# EAGLE design ampjack_v0001 (EAGLE 6.4)

## Sheet 1 of 11: MCU
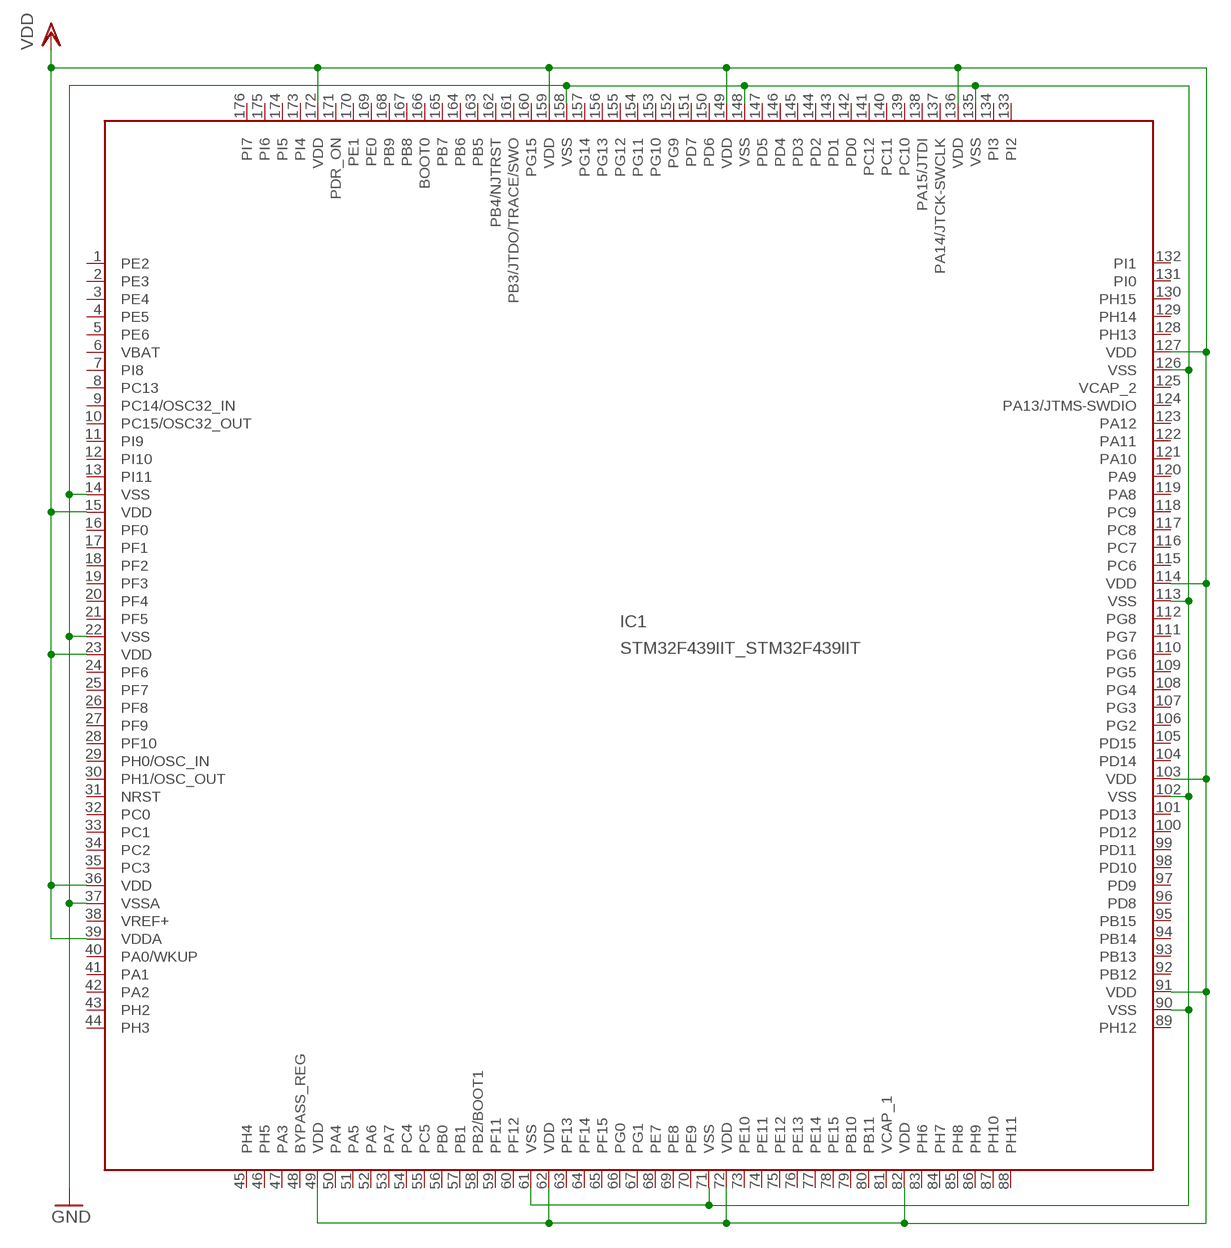
[diagram p0: schematic, sheet 1]

### Parts
IC1  STM32F439IIT_STM32F439IIT  [STM32F439IIT_LQFP-176]

### Nets
GND: IC1.14(VSS) IC1.22(VSS) IC1.37(VSSA) IC1.61(VSS) IC1.71(VSS) IC1.90(VSS) IC1.102(VSS) IC1.113(VSS) IC1.126(VSS) IC1.135(VSS) IC1.148(VSS) IC1.158(VSS) ; also sheet 5,6,7,8
VDD: IC1.15(VDD) IC1.23(VDD) IC1.36(VDD) IC1.39(VDDA) IC1.49(VDD) IC1.62(VDD) IC1.72(VDD) IC1.82(VDD) IC1.91(VDD) IC1.103(VDD) IC1.114(VDD) IC1.127(VDD) IC1.136(VDD) IC1.149(VDD) IC1.159(VDD) IC1.172(VDD)
Unconnected: IC1.1(PE2) IC1.2(PE3) IC1.3(PE4) IC1.4(PE5) IC1.5(PE6) IC1.7(PI8) IC1.8(PC13) IC1.9(PC14/OSC32_IN) IC1.10(PC15/OSC32_OUT) IC1.11(PI9) IC1.12(PI10) IC1.13(PI11) IC1.16(PF0) IC1.17(PF1) IC1.18(PF2) IC1.19(PF3) IC1.20(PF4) IC1.21(PF5) IC1.24(PF6) IC1.25(PF7) IC1.26(PF8) IC1.27(PF9) IC1.28(PF10) IC1.29(PH0/OSC_IN) IC1.30(PH1/OSC_OUT) IC1.31(NRST) IC1.32(PC0) IC1.33(PC1) IC1.34(PC2) IC1.35(PC3) IC1.40(PA0/WKUP) IC1.41(PA1) IC1.42(PA2) IC1.43(PH2) IC1.44(PH3) IC1.45(PH4) IC1.46(PH5) IC1.47(PA3) IC1.48(BYPASS_REG) IC1.50(PA4) IC1.51(PA5) IC1.52(PA6) IC1.53(PA7) IC1.54(PC4) IC1.55(PC5) IC1.56(PB0) IC1.57(PB1) IC1.58(PB2/BOOT1) IC1.59(PF11) IC1.60(PF12) IC1.63(PF13) IC1.64(PF14) IC1.65(PF15) IC1.66(PG0) IC1.67(PG1) IC1.68(PE7) IC1.69(PE8) IC1.70(PE9) IC1.73(PE10) IC1.74(PE11) IC1.75(PE12) IC1.76(PE13) IC1.77(PE14) IC1.78(PE15) IC1.79(PB10) IC1.80(PB11) IC1.83(PH6) IC1.84(PH7) IC1.85(PH8) IC1.86(PH9) IC1.87(PH10) IC1.88(PH11) IC1.89(PH12) IC1.92(PB12) IC1.93(PB13) IC1.94(PB14) IC1.95(PB15) IC1.96(PD8) IC1.97(PD9) IC1.98(PD10) IC1.99(PD11) IC1.100(PD12) IC1.101(PD13) IC1.104(PD14) IC1.105(PD15) IC1.106(PG2) IC1.107(PG3) IC1.108(PG4) IC1.109(PG5) IC1.110(PG6) IC1.111(PG7) IC1.112(PG8) IC1.115(PC6) IC1.116(PC7) IC1.117(PC8) IC1.118(PC9) IC1.119(PA8) IC1.120(PA9) IC1.121(PA10) IC1.122(PA11) IC1.123(PA12) IC1.124(PA13/JTMS-SWDIO) IC1.128(PH13) IC1.129(PH14) IC1.130(PH15) IC1.131(PI0) IC1.132(PI1) IC1.133(PI2) IC1.134(PI3) IC1.137(PA14/JTCK-SWCLK) IC1.138(PA15/JTDI) IC1.139(PC10) IC1.140(PC11) IC1.141(PC12) IC1.142(PD0) IC1.143(PD1) IC1.144(PD2) IC1.145(PD3) IC1.146(PD4) IC1.147(PD5) IC1.150(PD6) IC1.151(PD7) IC1.152(PG9) IC1.153(PG10) IC1.154(PG11) IC1.155(PG12) IC1.156(PG13) IC1.157(PG14) IC1.160(PG15) IC1.161(PB3/JTDO/TRACE/SWO) IC1.162(PB4/NJTRST) IC1.163(PB5) IC1.164(PB6) IC1.165(PB7) IC1.166(BOOT0) IC1.167(PB8) IC1.168(PB9) IC1.169(PE0) IC1.170(PE1) IC1.173(PI4) IC1.174(PI5) IC1.175(PI6) IC1.176(PI7)

## Sheet 2 of 11: HP_IN
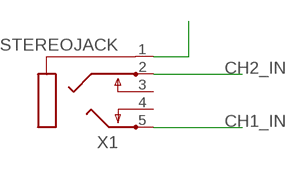
[diagram p1: schematic, sheet 2]

### Parts
X1  STEREOJACK  [STX3100]

### Nets
CH1_IN: X1.5 ; also sheet 5
CH2_IN: X1.2 ; also sheet 6
N$138: X1.1
Unconnected: X1.3 X1.4

## Sheet 3 of 11: Current - CH1

## Sheet 4 of 11: Current - CH2

## Sheet 5 of 11: AFE - CH1
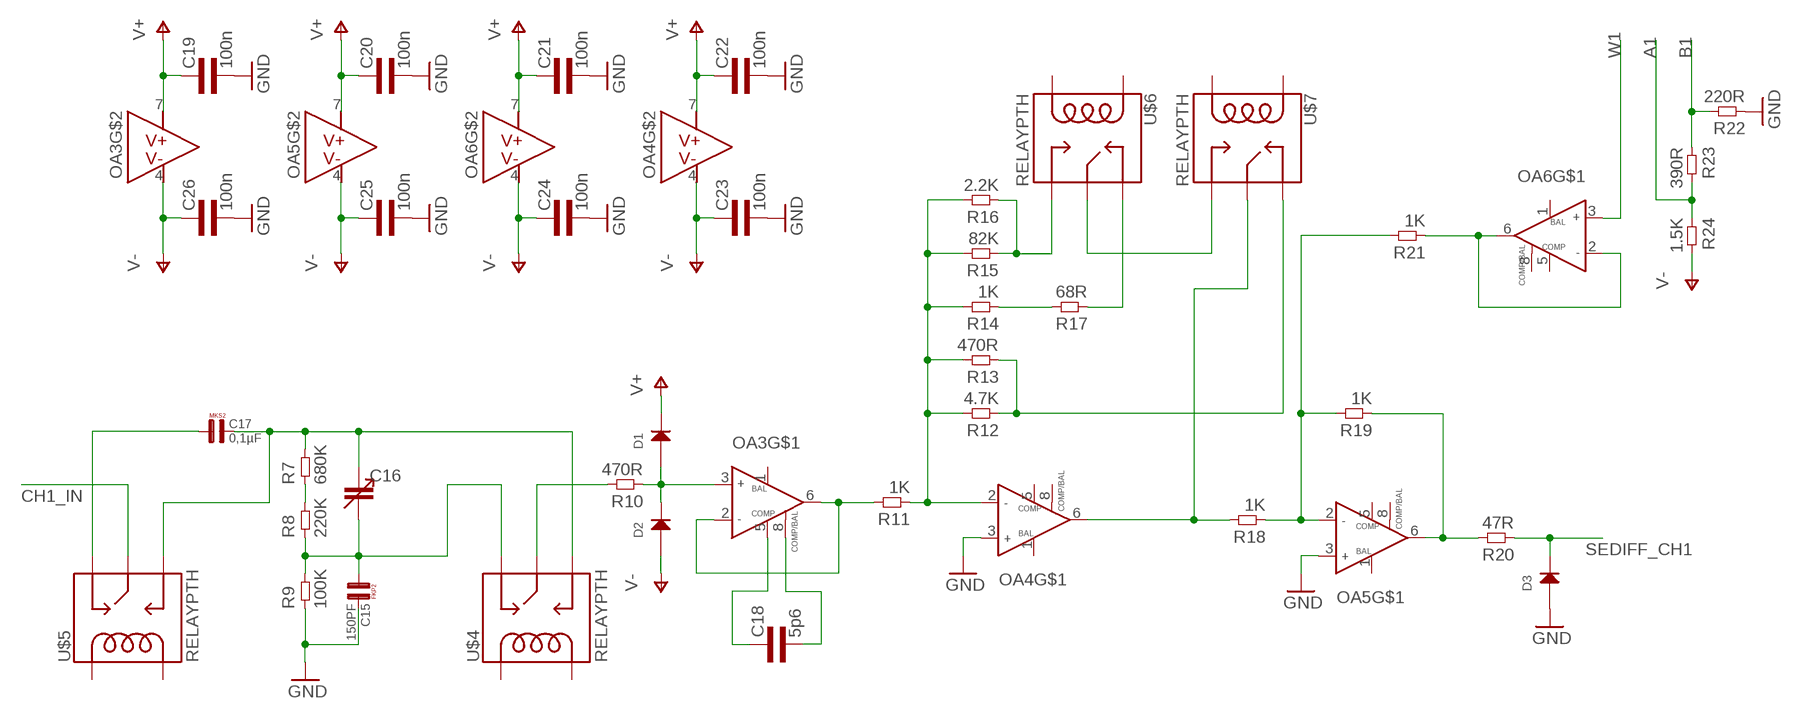
[diagram p2: schematic, sheet 5]

### Parts
C15  150PF  [R5B4K5]
C16  CAP_ADJSMD  [CTZ3]
C17  0,1µF  [R5B3]
C18  5p6  CAP0603L3  [0603L3]
C19  100n  CAP0603L3  [0603L3]
C20  100n  CAP0603L3  [0603L3]
C21  100n  CAP0603L3  [0603L3]
C22  100n  CAP0603L3  [0603L3]
C23  100n  CAP0603L3  [0603L3]
C24  100n  CAP0603L3  [0603L3]
C25  100n  CAP0603L3  [0603L3]
C26  100n  CAP0603L3  [0603L3]
D1  DIODEDO-214AC  [DO-214AC]
D2  DIODEDO-214AC  [DO-214AC]
D3  DIODEDO-214AC  [DO-214AC]
OA3  NE5534ADSOIC8  [SOIC-8]
OA4  NE5534ADSOIC8  [SOIC-8]
OA5  NE5534ADSOIC8  [SOIC-8]
OA6  NE5534ADSOIC8  [SOIC-8]
R7  680K  RES0805L3  [0805L3]
R8  220K  RES0805L3  [0805L3]
R9  100K  RES0805L3  [0805L3]
R10  470R  RES0805L3  [0805L3]
R11  1K  RES0805L3  [0805L3]
R12  4.7K  RES0805L3  [0805L3]
R13  470R  RES0805L3  [0805L3]
R14  1K  RES0805L3  [0805L3]
R15  82K  RES0805L3  [0805L3]
R16  2.2K  RES0805L3  [0805L3]
R17  68R  RES0805L3  [0805L3]
R18  1K  RES0805L3  [0805L3]
R19  1K  RES0805L3  [0805L3]
R20  47R  RES0805L3  [0805L3]
R21  1K  RES0805L3  [0805L3]
R22  220R  RES0805L3  [0805L3]
R23  390R  RES0805L3  [0805L3]
R24  1.5K  RES0805L3  [0805L3]
U$4  RELAYPTH  [RELAY-G5Q]
U$5  RELAYPTH  [RELAY-G5Q]
U$6  RELAYPTH  [RELAY-G5Q]
U$7  RELAYPTH  [RELAY-G5Q]

### Nets
A1: R23.2 R24.1 ; also sheet 9
B1: R22.2 R23.1 ; also sheet 9
CH1_IN: U$5.2(MAIN) ; also sheet 2
GND: C15.2 C19.P$2 C20.P$2 C21.P$2 C22.P$2 C23.P$2 C24.P$2 C25.P$2 C26.P$2 D3.1(ANODE) OA4.3(IN+) OA5.3(IN+) R9.1 R22.1 ; also sheet 1,6,7,8
N$42: C17.1 U$5.4(NC)
N$43: C16.+ C17.2 R7.2 U$4.3(NO) U$5.3(NO)
N$44: R7.1 R8.2
N$45: C15.1 C16.- R8.1 R9.2 U$4.4(NC)
N$48: R10.2 U$4.2(MAIN)
N$49: D1.1(ANODE) D2.2(CATHODE) OA3.3(IN+) R10.1
N$52: OA3.2(IN-) OA3.6(OUT) R11.2
N$53: C18.P$1 OA3.5(COMP)
N$54: C18.P$2 OA3.8(COMP/BAL)
N$55: OA4.2(IN-) R11.1 R12.2 R13.2 R14.2 R15.2 R16.2
N$56: R12.1 R13.1 U$7.4(NC)
N$57: U$6.2(MAIN) U$7.3(NO)
N$58: R14.1 R17.2
N$59: R17.1 U$6.4(NC)
N$60: R15.1 R16.1 U$6.3(NO)
N$61: OA4.6(OUT) R18.2 U$7.2(MAIN)
N$62: OA5.2(IN-) R18.1 R19.2 R21.2
N$63: OA5.6(OUT) R19.1 R20.2
N$65: OA6.2(IN-) OA6.6(OUT) R21.1
SEDIFF_CH1: D3.2(CATHODE) R20.1 ; also sheet 7
V+: C19.P$1 C20.P$1 C21.P$1 C22.P$1 D1.2(CATHODE) OA3.7(V+) OA4.7(V+) OA5.7(V+) OA6.7(V+) ; also sheet 6,7,8
V-: C23.P$1 C24.P$1 C25.P$1 C26.P$1 D2.1(ANODE) OA3.4(V-) OA4.4(V-) OA5.4(V-) OA6.4(V-) R24.2 ; also sheet 6,7,8
W1: OA6.3(IN+) ; also sheet 9
Unconnected: OA3.1(BAL) OA4.1(BAL) OA4.5(COMP) OA4.8(COMP/BAL) OA5.1(BAL) OA5.5(COMP) OA5.8(COMP/BAL) OA6.1(BAL) OA6.5(COMP) OA6.8(COMP/BAL) U$4.1(COIL2) U$4.5(COIL1) U$5.1(COIL2) U$5.5(COIL1) U$6.1(COIL2) U$6.5(COIL1) U$7.1(COIL2) U$7.5(COIL1)

## Sheet 6 of 11: AFE - CH2
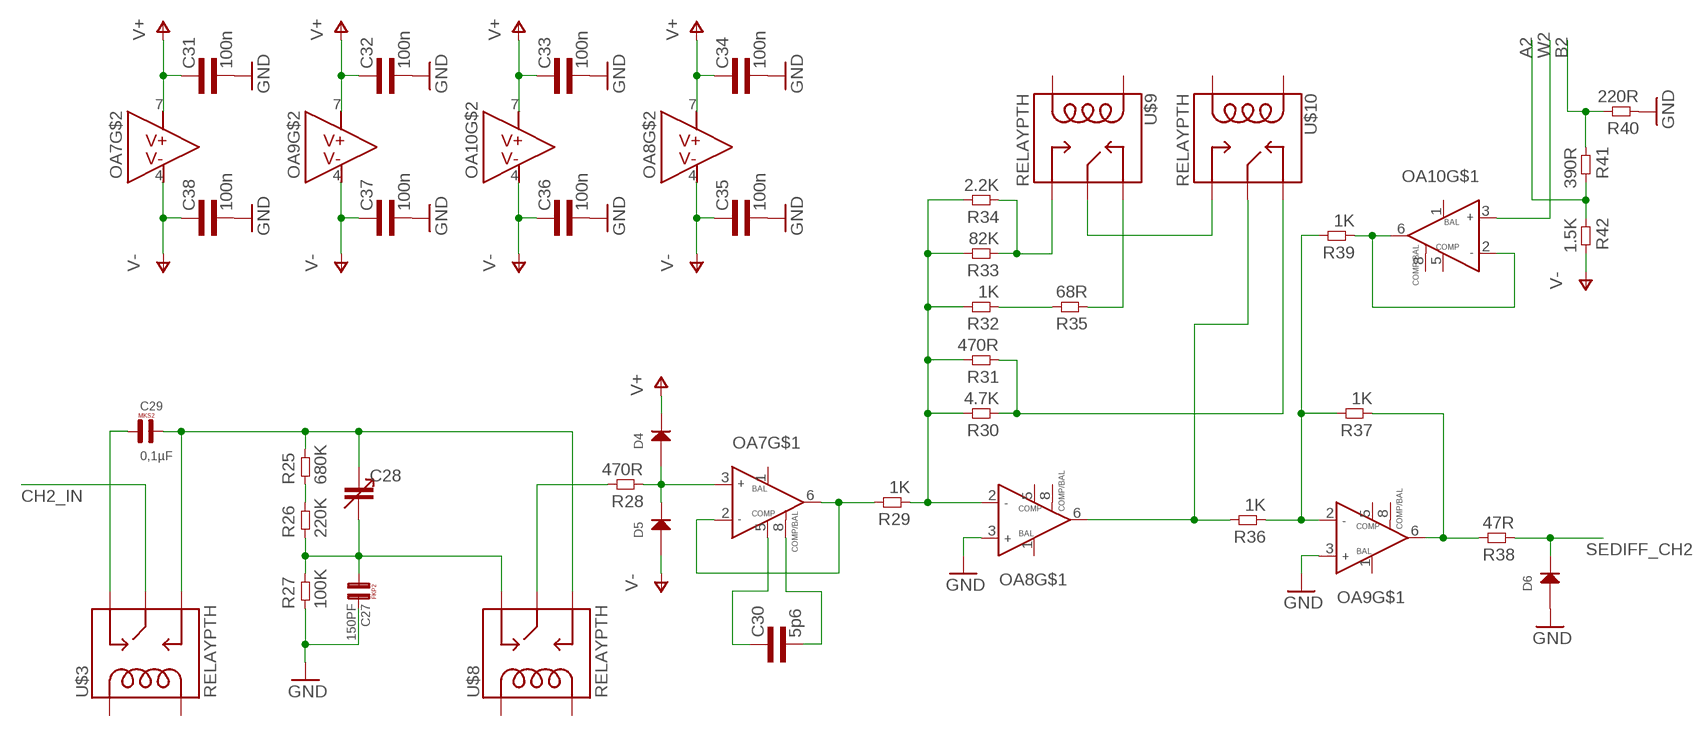
[diagram p3: schematic, sheet 6]

### Parts
C27  150PF  [R5B4K5]
C28  CAP_ADJSMD  [CTZ3]
C29  0,1µF  [R5B3]
C30  5p6  CAP0603L3  [0603L3]
C31  100n  CAP0603L3  [0603L3]
C32  100n  CAP0603L3  [0603L3]
C33  100n  CAP0603L3  [0603L3]
C34  100n  CAP0603L3  [0603L3]
C35  100n  CAP0603L3  [0603L3]
C36  100n  CAP0603L3  [0603L3]
C37  100n  CAP0603L3  [0603L3]
C38  100n  CAP0603L3  [0603L3]
D4  DIODEDO-214AC  [DO-214AC]
D5  DIODEDO-214AC  [DO-214AC]
D6  DIODEDO-214AC  [DO-214AC]
OA7  NE5534ADSOIC8  [SOIC-8]
OA8  NE5534ADSOIC8  [SOIC-8]
OA9  NE5534ADSOIC8  [SOIC-8]
OA10  NE5534ADSOIC8  [SOIC-8]
R25  680K  RES0805L3  [0805L3]
R26  220K  RES0805L3  [0805L3]
R27  100K  RES0805L3  [0805L3]
R28  470R  RES0805L3  [0805L3]
R29  1K  RES0805L3  [0805L3]
R30  4.7K  RES0805L3  [0805L3]
R31  470R  RES0805L3  [0805L3]
R32  1K  RES0805L3  [0805L3]
R33  82K  RES0805L3  [0805L3]
R34  2.2K  RES0805L3  [0805L3]
R35  68R  RES0805L3  [0805L3]
R36  1K  RES0805L3  [0805L3]
R37  1K  RES0805L3  [0805L3]
R38  47R  RES0805L3  [0805L3]
R39  1K  RES0805L3  [0805L3]
R40  220R  RES0805L3  [0805L3]
R41  390R  RES0805L3  [0805L3]
R42  1.5K  RES0805L3  [0805L3]
U$3  RELAYPTH  [RELAY-G5Q]
U$8  RELAYPTH  [RELAY-G5Q]
U$9  RELAYPTH  [RELAY-G5Q]
U$10  RELAYPTH  [RELAY-G5Q]

### Nets
A2: R41.2 R42.1 ; also sheet 9
B2: R40.2 R41.1 ; also sheet 9
CH2_IN: U$3.2(MAIN) ; also sheet 2
GND: C27.2 C31.P$2 C32.P$2 C33.P$2 C34.P$2 C35.P$2 C36.P$2 C37.P$2 C38.P$2 D6.1(ANODE) OA8.3(IN+) OA9.3(IN+) R27.1 R40.1 ; also sheet 1,5,7,8
N$46: C29.1 U$3.4(NC)
N$47: C28.+ C29.2 R25.2 U$3.3(NO) U$8.3(NO)
N$50: R25.1 R26.2
N$51: C27.1 C28.- R26.1 R27.2 U$8.4(NC)
N$66: R28.2 U$8.2(MAIN)
N$68: D4.1(ANODE) D5.2(CATHODE) OA7.3(IN+) R28.1
N$69: OA7.2(IN-) OA7.6(OUT) R29.2
N$70: C30.P$1 OA7.5(COMP)
N$71: C30.P$2 OA7.8(COMP/BAL)
N$72: OA8.2(IN-) R29.1 R30.2 R31.2 R32.2 R33.2 R34.2
N$73: R30.1 R31.1 U$10.4(NC)
N$74: U$9.2(MAIN) U$10.3(NO)
N$75: R32.1 R35.2
N$76: R35.1 U$9.4(NC)
N$77: R33.1 R34.1 U$9.3(NO)
N$78: OA8.6(OUT) R36.2 U$10.2(MAIN)
N$79: OA9.2(IN-) R36.1 R37.2 R39.2
N$80: OA9.6(OUT) R37.1 R38.2
N$82: OA10.2(IN-) OA10.6(OUT) R39.1
SEDIFF_CH2: D6.2(CATHODE) R38.1 ; also sheet 8
V+: C31.P$1 C32.P$1 C33.P$1 C34.P$1 D4.2(CATHODE) OA7.7(V+) OA8.7(V+) OA9.7(V+) OA10.7(V+) ; also sheet 5,7,8
V-: C35.P$1 C36.P$1 C37.P$1 C38.P$1 D5.1(ANODE) OA7.4(V-) OA8.4(V-) OA9.4(V-) OA10.4(V-) R42.2 ; also sheet 5,7,8
W2: OA10.3(IN+) ; also sheet 9
Unconnected: OA7.1(BAL) OA8.1(BAL) OA8.5(COMP) OA8.8(COMP/BAL) OA9.1(BAL) OA9.5(COMP) OA9.8(COMP/BAL) OA10.1(BAL) OA10.5(COMP) OA10.8(COMP/BAL) U$3.1(COIL2) U$3.5(COIL1) U$8.1(COIL2) U$8.5(COIL1) U$9.1(COIL2) U$9.5(COIL1) U$10.1(COIL2) U$10.5(COIL1)

## Sheet 7 of 11: SE to Diff - CH1
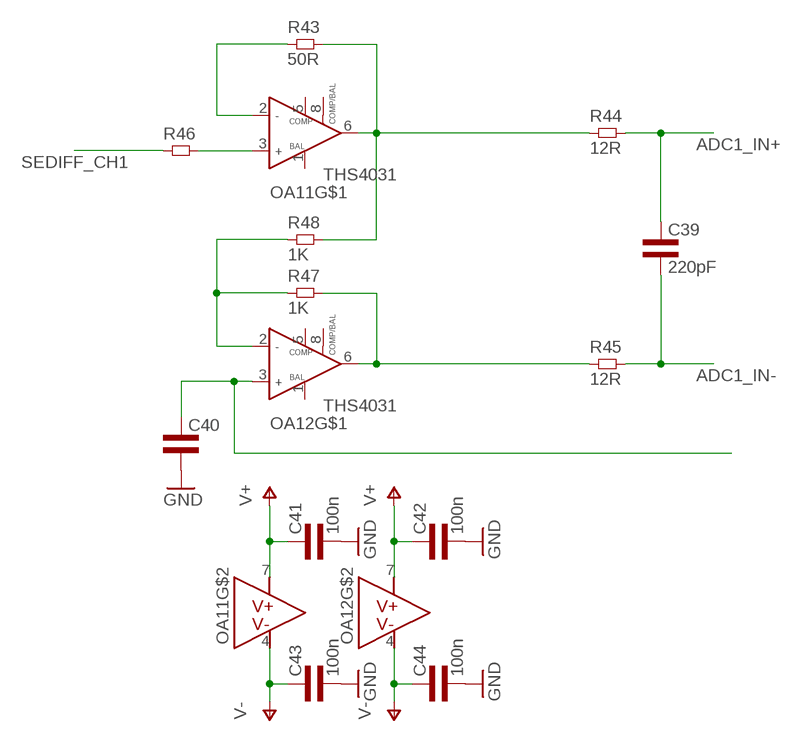
[diagram p4: schematic, sheet 7]

### Parts
C39  220pF  CAP0603L3  [0603L3]
C40  CAP0603L3  [0603L3]
C41  100n  CAP0603L3  [0603L3]
C42  100n  CAP0603L3  [0603L3]
C43  100n  CAP0603L3  [0603L3]
C44  100n  CAP0603L3  [0603L3]
OA11  THS4031  NE5534DSOIC8  [SOIC-8]
OA12  THS4031  NE5534DSOIC8  [SOIC-8]
R43  50R  RES0603L3  [0603L3]
R44  12R  RES0603L3  [0603L3]
R45  12R  RES0603L3  [0603L3]
R46  RES0603L3  [0603L3]
R47  1K  RES0603L3  [0603L3]
R48  1K  RES0603L3  [0603L3]

### Nets
ADC1_COMMOUT: C40.P$1 OA12.3(IN+) ; also sheet 10
ADC1_IN+: C39.P$1 R44.P$2 ; also sheet 10
ADC1_IN-: C39.P$2 R45.P$2 ; also sheet 10
GND: C40.P$2 C41.P$2 C42.P$2 C43.P$2 C44.P$2 ; also sheet 1,5,6,8
N$84: OA11.6(OUT) R43.P$2 R44.P$1 R48.P$2
N$85: OA12.6(OUT) R45.P$1 R47.P$2
N$89: OA11.2(IN-) R43.P$1
N$90: OA11.3(IN+) R46.P$2
N$91: OA12.2(IN-) R47.P$1 R48.P$1
SEDIFF_CH1: R46.P$1 ; also sheet 5
V+: C41.P$1 C42.P$1 OA11.7(V+) OA12.7(V+) ; also sheet 5,6,8
V-: C43.P$1 C44.P$1 OA11.4(V-) OA12.4(V-) ; also sheet 5,6,8
Unconnected: OA11.1(BAL) OA11.5(COMP) OA11.8(COMP/BAL) OA12.1(BAL) OA12.5(COMP) OA12.8(COMP/BAL)

## Sheet 8 of 11: SE to Diff - CH2
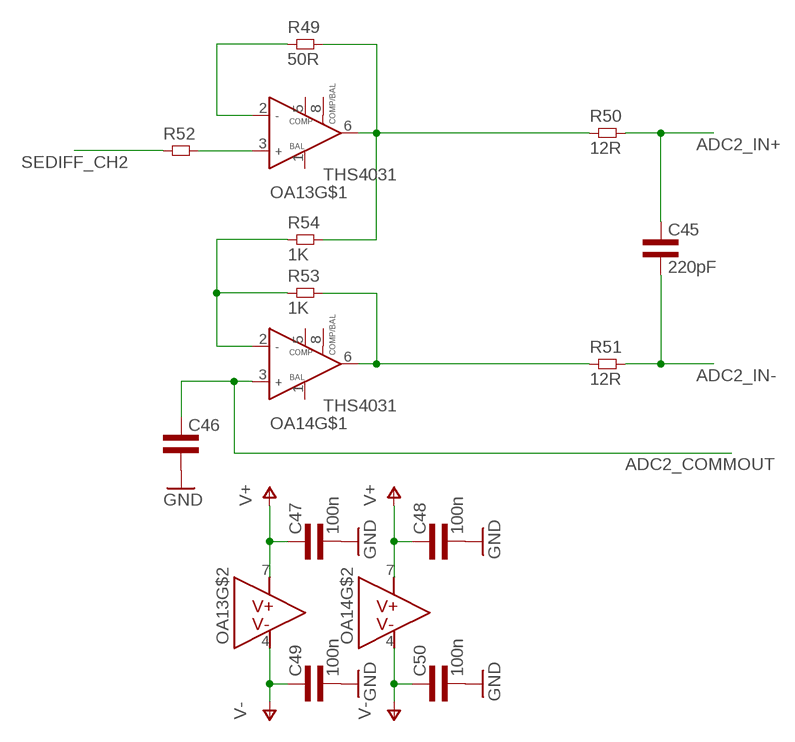
[diagram p5: schematic, sheet 8]

### Parts
C45  220pF  CAP0603L3  [0603L3]
C46  CAP0603L3  [0603L3]
C47  100n  CAP0603L3  [0603L3]
C48  100n  CAP0603L3  [0603L3]
C49  100n  CAP0603L3  [0603L3]
C50  100n  CAP0603L3  [0603L3]
OA13  THS4031  NE5534DSOIC8  [SOIC-8]
OA14  THS4031  NE5534DSOIC8  [SOIC-8]
R49  50R  RES0603L3  [0603L3]
R50  12R  RES0603L3  [0603L3]
R51  12R  RES0603L3  [0603L3]
R52  RES0603L3  [0603L3]
R53  1K  RES0603L3  [0603L3]
R54  1K  RES0603L3  [0603L3]

### Nets
ADC2_COMMOUT: C46.P$1 OA14.3(IN+) ; also sheet 11
ADC2_IN+: C45.P$1 R50.P$2 ; also sheet 11
ADC2_IN-: C45.P$2 R51.P$2 ; also sheet 11
GND: C46.P$2 C47.P$2 C48.P$2 C49.P$2 C50.P$2 ; also sheet 1,5,6,7
N$94: OA13.6(OUT) R49.P$2 R50.P$1 R54.P$2
N$95: OA14.6(OUT) R51.P$1 R53.P$2
N$98: OA13.2(IN-) R49.P$1
N$99: OA13.3(IN+) R52.P$2
N$100: OA14.2(IN-) R53.P$1 R54.P$1
SEDIFF_CH2: R52.P$1 ; also sheet 6
V+: C47.P$1 C48.P$1 OA13.7(V+) OA14.7(V+) ; also sheet 5,6,7
V-: C49.P$1 C50.P$1 OA13.4(V-) OA14.4(V-) ; also sheet 5,6,7
Unconnected: OA13.1(BAL) OA13.5(COMP) OA13.8(COMP/BAL) OA14.1(BAL) OA14.5(COMP) OA14.8(COMP/BAL)

## Sheet 9 of 11: Digi Pot
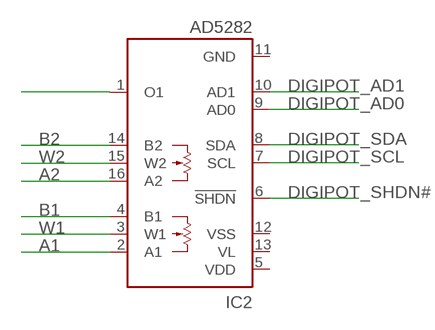
[diagram p6: schematic, sheet 9]

### Parts
IC2  AD5282  [TSSOP16]

### Nets
A1: IC2.2(A1) ; also sheet 5
A2: IC2.16(A2) ; also sheet 6
B1: IC2.4(B1) ; also sheet 5
B2: IC2.14(B2) ; also sheet 6
DIGIPOT_AD0: IC2.9(AD0)
DIGIPOT_AD1: IC2.10(AD1)
DIGIPOT_SCL: IC2.7(SCL)
DIGIPOT_SDA: IC2.8(SDA)
DIGIPOT_SHDN#: IC2.6(!SHDN)
N$87: IC2.1(O1)
W1: IC2.3(W1) ; also sheet 5
W2: IC2.15(W2) ; also sheet 6

## Sheet 10 of 11: ADC - CH1
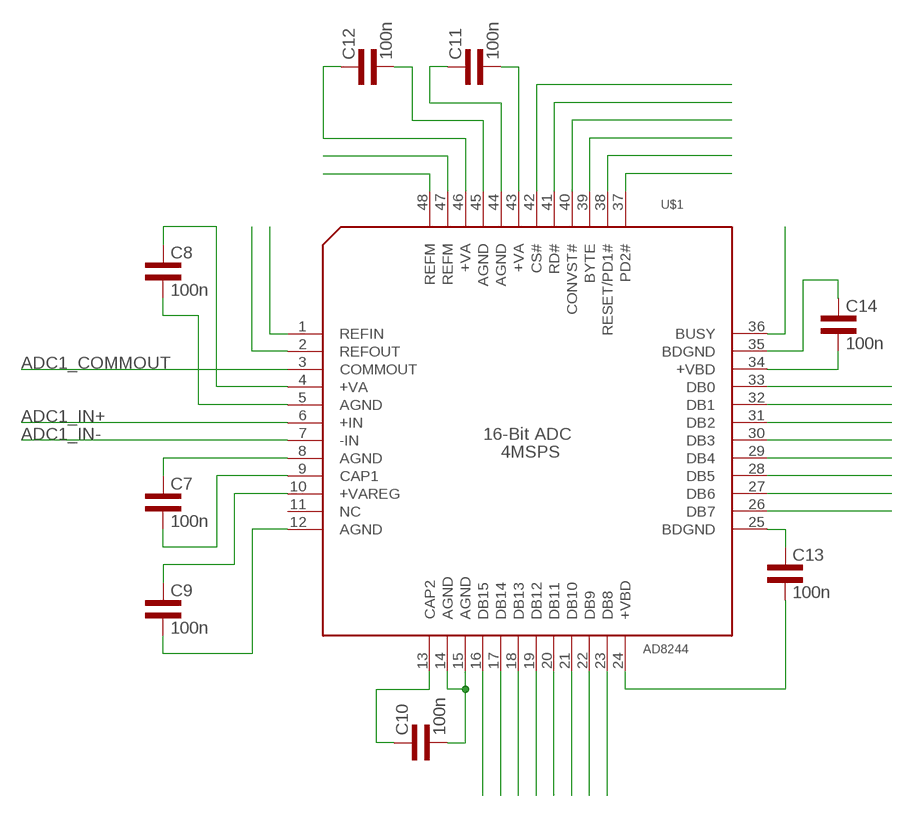
[diagram p7: schematic, sheet 10]

### Parts
C7  100n  CAP0402L3  [0402L3]
C8  100n  CAP0402L3  [0402L3]
C9  100n  CAP0402L3  [0402L3]
C10  100n  CAP0402L3  [0402L3]
C11  100n  CAP0402L3  [0402L3]
C12  100n  CAP0402L3  [0402L3]
C13  100n  CAP0402L3  [0402L3]
C14  100n  CAP0402L3  [0402L3]
U$1  AD8422  [S-PQFP-G48]

### Nets
ADC1_COMMOUT: U$1.3(COMMOUT) ; also sheet 7
ADC1_IN+: U$1.6(+IN) ; also sheet 7
ADC1_IN-: U$1.7(-IN) ; also sheet 7
N$10: U$1.16(DB15)
N$11: U$1.17(DB14)
N$12: U$1.18(DB13)
N$13: U$1.19(DB12)
N$14: U$1.20(DB11)
N$15: U$1.21(DB10)
N$16: U$1.22(DB9)
N$17: U$1.23(DB8)
N$18: U$1.26(DB7)
N$19: U$1.27(DB6)
N$20: U$1.28(DB5)
N$21: U$1.29(DB4)
N$22: U$1.30(DB3)
N$23: U$1.31(DB2)
N$24: U$1.32(DB1)
N$25: U$1.33(DB0)
N$26: C8.P$2 U$1.5(AGND)
N$27: C8.P$1 U$1.4(+VA)
N$28: C7.P$1 U$1.8(AGND)
N$29: C7.P$2 U$1.9(CAP1)
N$30: C9.P$1 U$1.10(+VAREG)
N$31: C9.P$2 U$1.12(AGND)
N$32: C10.P$1 U$1.13(CAP2)
N$33: C10.P$2 U$1.14(AGND) U$1.15(AGND)
N$34: C11.P$1 U$1.44(AGND)
N$35: C11.P$2 U$1.43(+VA)
N$36: C12.P$2 U$1.45(AGND)
N$37: C12.P$1 U$1.46(+VA)
N$38: C13.P$1 U$1.25(BDGND)
N$39: C13.P$2 U$1.24(+VBD)
N$40: C14.P$2 U$1.34(+VBD)
N$41: C14.P$1 U$1.35(BDGND)
N$127: U$1.48(REFM)
N$128: U$1.47(REFM)
N$129: U$1.1(REFIN)
N$130: U$1.2(REFOUT)
N$131: U$1.36(BUSY)
N$132: U$1.37(PD2#)
N$133: U$1.38(RESET/PD1#)
N$134: U$1.39(BYTE)
N$135: U$1.40(CONVST#)
N$136: U$1.41(RD#)
N$137: U$1.42(CS#)
Unconnected: U$1.11(NC)

## Sheet 11 of 11: ADC - CH2
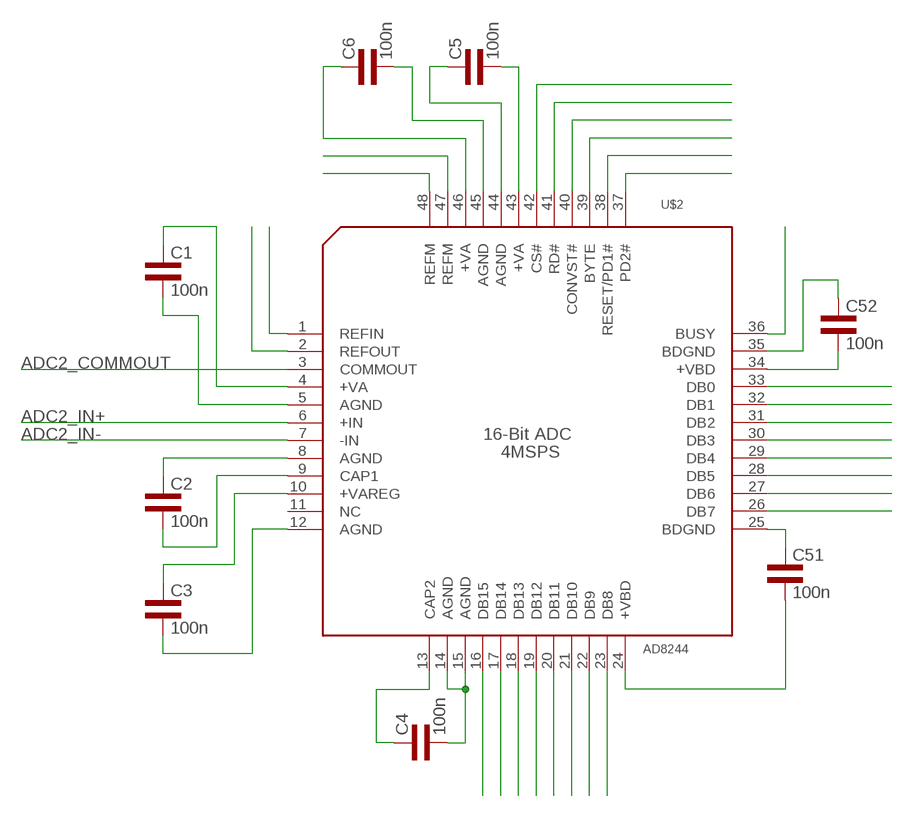
[diagram p8: schematic, sheet 11]

### Parts
C1  100n  CAP0402L3  [0402L3]
C2  100n  CAP0402L3  [0402L3]
C3  100n  CAP0402L3  [0402L3]
C4  100n  CAP0402L3  [0402L3]
C5  100n  CAP0402L3  [0402L3]
C6  100n  CAP0402L3  [0402L3]
C51  100n  CAP0402L3  [0402L3]
C52  100n  CAP0402L3  [0402L3]
U$2  AD8422  [S-PQFP-G48]

### Nets
ADC2_COMMOUT: U$2.3(COMMOUT) ; also sheet 8
ADC2_IN+: U$2.6(+IN) ; also sheet 8
ADC2_IN-: U$2.7(-IN) ; also sheet 8
N$1: U$2.1(REFIN)
N$2: U$2.16(DB15)
N$3: U$2.17(DB14)
N$4: U$2.18(DB13)
N$5: U$2.19(DB12)
N$6: U$2.20(DB11)
N$7: U$2.21(DB10)
N$8: U$2.2(REFOUT)
N$9: U$2.22(DB9)
N$64: U$2.23(DB8)
N$81: U$2.26(DB7)
N$86: U$2.27(DB6)
N$88: U$2.28(DB5)
N$92: U$2.36(BUSY)
N$93: U$2.29(DB4)
N$96: U$2.30(DB3)
N$97: U$2.31(DB2)
N$101: U$2.48(REFM)
N$102: U$2.32(DB1)
N$103: U$2.33(DB0)
N$104: C1.P$2 U$2.5(AGND)
N$105: C1.P$1 U$2.4(+VA)
N$106: C2.P$1 U$2.8(AGND)
N$107: C2.P$2 U$2.9(CAP1)
N$108: C3.P$1 U$2.10(+VAREG)
N$109: C3.P$2 U$2.12(AGND)
N$110: C4.P$1 U$2.13(CAP2)
N$111: C4.P$2 U$2.14(AGND) U$2.15(AGND)
N$112: C5.P$1 U$2.44(AGND)
N$113: C5.P$2 U$2.43(+VA)
N$114: C6.P$2 U$2.45(AGND)
N$115: C6.P$1 U$2.46(+VA)
N$116: C51.P$1 U$2.25(BDGND)
N$117: C51.P$2 U$2.24(+VBD)
N$118: C52.P$2 U$2.34(+VBD)
N$119: C52.P$1 U$2.35(BDGND)
N$120: U$2.47(REFM)
N$121: U$2.37(PD2#)
N$122: U$2.38(RESET/PD1#)
N$123: U$2.39(BYTE)
N$124: U$2.40(CONVST#)
N$125: U$2.41(RD#)
N$126: U$2.42(CS#)
Unconnected: U$2.11(NC)

## Power pins joined to a net without a drawn wire
GND: IC2.11(GND)
PDR_ON: IC1.171(PDR_ON)
VBAT: IC1.6(VBAT)
VCAP_1: IC1.81(VCAP_1)
VCAP_2: IC1.125(VCAP_2)
VDD: IC2.5(VDD)
VL: IC2.13(VL)
VREF+: IC1.38(VREF+)
VSS: IC2.12(VSS)

## Library data of the parts
C1-C14 C18-C26 C30-C52 = common:CAP
C15 C27 = Capacitor-Wima-FKP2-100v:150PF
C16 C28 = SparkFun-Passives:CAP_ADJ: Variable, non-polarized capacitor
C17 C29 = Capacitor-Wima-MKS2-100v:0,1µF
D1-D6 = common:DIODE
IC1 = Logic - Copy:STM32F439IIT_STM32F439IIT: edit this description Auto generated by make-symbol-device-package-bsdl.ulp Rev. 43 Source:
IC2 = analog-devices:AD5282: Dual +15 V/±5 V, 256-Position, I2C-Compatible Digital Potentiometer Source: http://www.analog.com/static/imported-files/data_sheets/AD5280_5282.pdf; MF: ALTERA CORPORATION; MPN: AD5282BRUZ50; OC_FARNELL: 1438442; OC_NEWARK: 59K3850
OA3-OA10 = common:NE5534: Low-noise, high-SP audio Op Amp.; BIAS_CURRENT: 500nA; CMRR: 100dB; GAIN_BANDWIDTH_PRODUCT: 10MHz; IN-VOL_NOISE_DENSITY: 3.5nV; OFFSET_VOL: 500uV; OUTPUT_CURRENT: 38mA; SLEW_RATE: 13V/uS; SUPPLY_CURRENT: 4mA; SUPPLY_VOL_MAX: 30V; SUPPLY_VOL_MIN: 10V
OA11-OA14 = common:NE5534: Low-noise, high-SP audio Op Amp.; BIAS_CURRENT: 1.5uA; CMRR: 100dB; GAIN_BANDWIDTH_PRODUCT: 10MHz; IN-VOL_NOISE_DENSITY: 3.5nV; OFFSET_VOL: 4mV; OUTPUT_CURRENT: 38mA; SLEW_RATE: 13V/uS; SUPPLY_CURRENT: 4mA; SUPPLY_VOL_MAX: 30V; SUPPLY_VOL_MIN: 10V
R7-R54 = common:RES
U$1 U$2 = common:AD8422: 16-Bit SAR ADC - 4MSPS
U$3-U$10 = SparkFun-Electromechanical:RELAY: SPDT relay (COM-00101)
X1 = adafruit:STEREOJACK: MIC/HEADPHONE JACK Stereo jack with two switches. Kycon STX3100, CUI SJ1-3555NG and/or 4UCon 05544

## Board
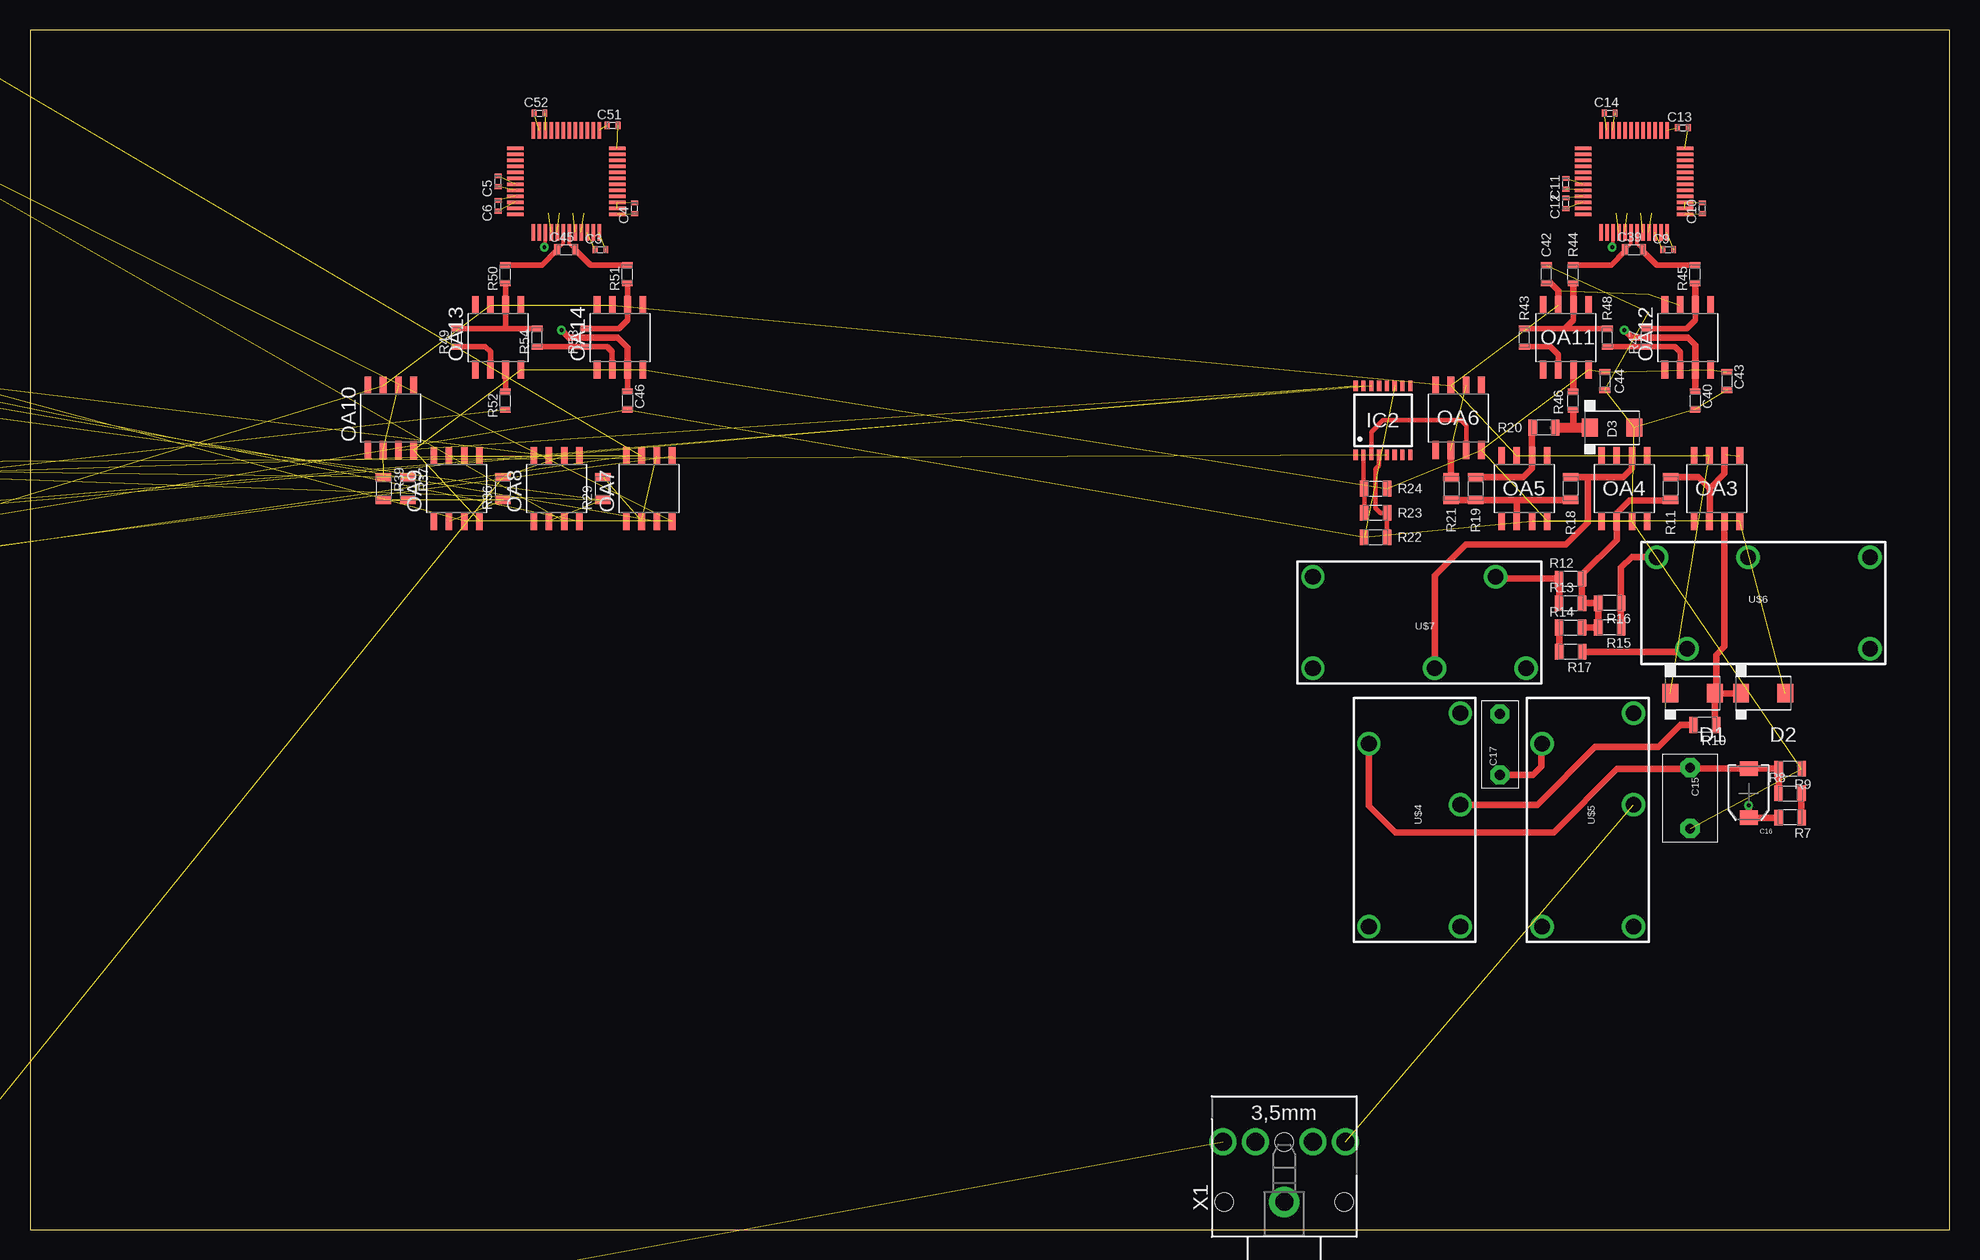
[diagram p9: board, top side]
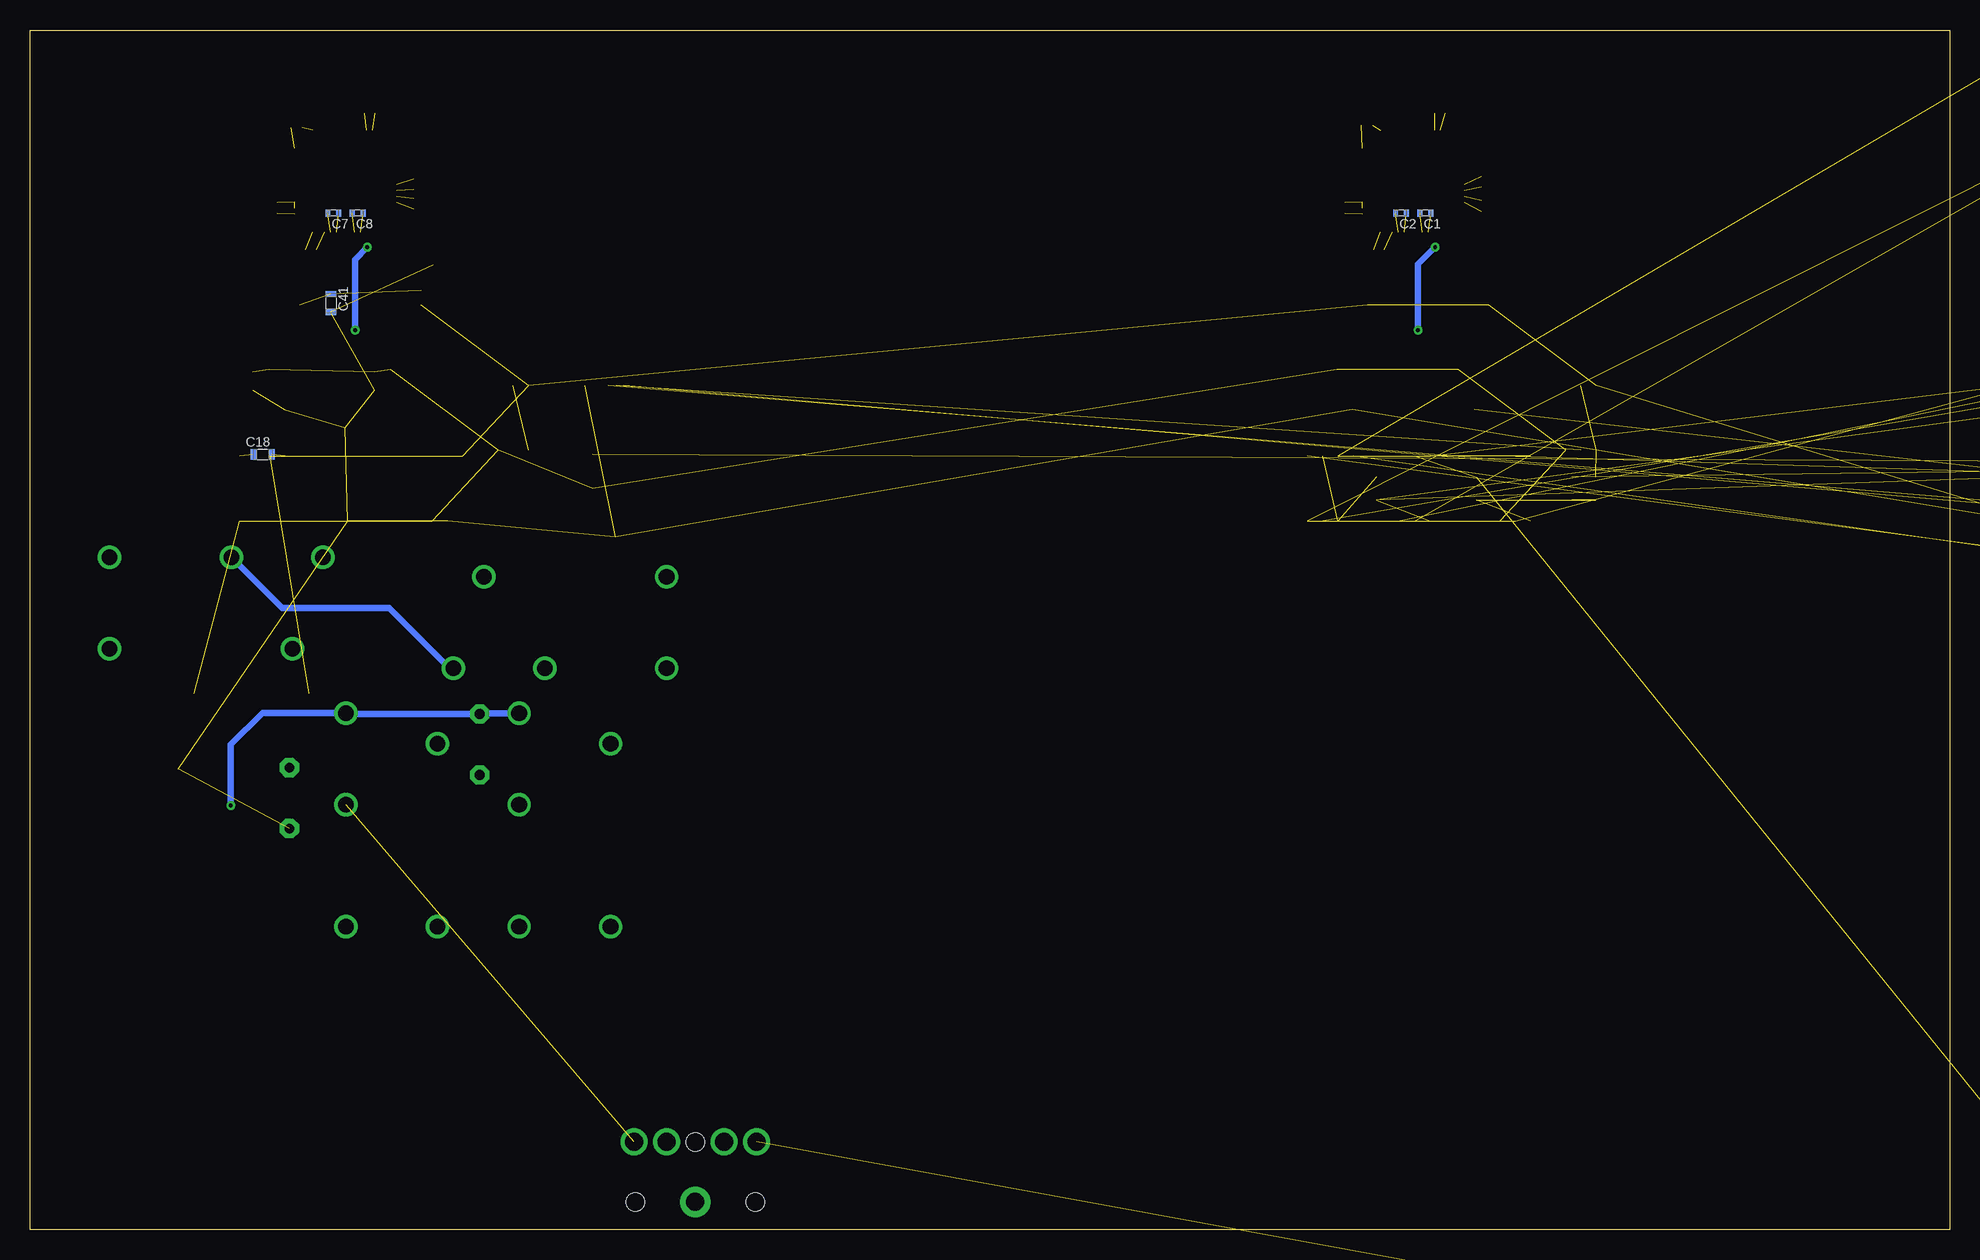
[diagram p10: board, bottom side, seen from below]

Size 160 x 100 mm. Coordinates in mm from the lower left corner, seen from the top.
Outline: 0,0 160,0 160,100 0,100 0,0
Copper layers (1*16): Top 0.035mm / dielectric 1.5mm / Bottom 0.035mm
Design rules "default": minimum track width 10mil, minimum drill 24mil, track to track 8mil, track to pad 8mil, pad to pad 8mil, via to via 8mil, smd to smd 8mil, copper to edge 40mil, drill to drill 8mil, minimum pad ring 10mil, minimum via ring 8mil, stop-mask expansion 4mil, vias tented up to drill 0mil, thermal gap 10mil

### Footprints (pad centres in the part's own frame; a part is rotated, then mirrored left to right if it is on the bottom)
0402L3 = smd 0.4 x 0.6: P$1 -0.45,0; P$2 0.45,0
R5B4K5 = drill 0.813 pad 1.6 octagon: 1 -2.54,0; 2 2.54,0
CTZ3 = smd 1.5 x 1.2: + 0,2.05; - 0,-2.05
R5B3 = drill 0.813 pad 1.6 octagon: 1 -2.54,0; 2 2.54,0
0603L3 = smd 0.5 x 0.9: P$1 -0.75,0; P$2 0.75,0
DO-214AC = smd 1.32 x 1.52: 1 -1.85,0; 2 1.85,0
STM32F439IIT_LQFP-176 = smd 1.2 x 0.3: 1 -13.25,10.75; 2 -13.25,10.25; 3 -13.25,9.75; 4 -13.25,9.25; 5 -13.25,8.75; 6 -13.25,8.25; 7 -13.25,7.75; 8 -13.25,7.25; 9 -13.25,6.75; 10 -13.25,6.25; 11 -13.25,5.75; 12 -13.25,5.25; 13 -13.25,4.75; 14 -13.25,4.25; 15 -13.25,3.75; 16 -13.25,3.25; 17 -13.25,2.75; 18 -13.25,2.25; 19 -13.25,1.75; 20 -13.25,1.25; 21 -13.25,0.75; 22 -13.25,0.25; 23 -13.25,-0.25; 24 -13.25,-0.75; 25 -13.25,-1.25; 26 -13.25,-1.75; 27 -13.25,-2.25; 28 -13.25,-2.75; 29 -13.25,-3.25; 30 -13.25,-3.75; 31 -13.25,-4.25; 32 -13.25,-4.75; 33 -13.25,-5.25; 34 -13.25,-5.75; 35 -13.25,-6.25; 36 -13.25,-6.75; 37 -13.25,-7.25; 38 -13.25,-7.75; 39 -13.25,-8.25; 40 -13.25,-8.75; 41 -13.25,-9.25; 42 -13.25,-9.75; 43 -13.25,-10.25; 44 -13.25,-10.75; 89 13.25,-10.75; 90 13.25,-10.25; 91 13.25,-9.75; 92 13.25,-9.25; 93 13.25,-8.75; 94 13.25,-8.25; 95 13.25,-7.75; 96 13.25,-7.25; 97 13.25,-6.75; 98 13.25,-6.25; 99 13.25,-5.75; 100 13.25,-5.25; 101 13.25,-4.75; 102 13.25,-4.25; 103 13.25,-3.75; 104 13.25,-3.25; 105 13.25,-2.75; 106 13.25,-2.25; 107 13.25,-1.75; 108 13.25,-1.25; 109 13.25,-0.75; 110 13.25,-0.25; 111 13.25,0.25; 112 13.25,0.75; 113 13.25,1.25; 114 13.25,1.75; 115 13.25,2.25; 116 13.25,2.75; 117 13.25,3.25; 118 13.25,3.75; 119 13.25,4.25; 120 13.25,4.75; 121 13.25,5.25; 122 13.25,5.75; 123 13.25,6.25; 124 13.25,6.75; 125 13.25,7.25; 126 13.25,7.75; 127 13.25,8.25; 128 13.25,8.75; 129 13.25,9.25; 130 13.25,9.75; 131 13.25,10.25; 132 13.25,10.75 | smd 0.3 x 1.2: 45 -10.75,-13.25; 46 -10.25,-13.25; 47 -9.75,-13.25; 48 -9.25,-13.25; 49 -8.75,-13.25; 50 -8.25,-13.25; 51 -7.75,-13.25; 52 -7.25,-13.25; 53 -6.75,-13.25; 54 -6.25,-13.25; 55 -5.75,-13.25; 56 -5.25,-13.25; 57 -4.75,-13.25; 58 -4.25,-13.25; 59 -3.75,-13.25; 60 -3.25,-13.25; 61 -2.75,-13.25; 62 -2.25,-13.25; 63 -1.75,-13.25; 64 -1.25,-13.25; 65 -0.75,-13.25; 66 -0.25,-13.25; 67 0.25,-13.25; 68 0.75,-13.25; 69 1.25,-13.25; 70 1.75,-13.25; 71 2.25,-13.25; 72 2.75,-13.25; 73 3.25,-13.25; 74 3.75,-13.25; 75 4.25,-13.25; 76 4.75,-13.25; 77 5.25,-13.25; 78 5.75,-13.25; 79 6.25,-13.25; 80 6.75,-13.25; 81 7.25,-13.25; 82 7.75,-13.25; 83 8.25,-13.25; 84 8.75,-13.25; 85 9.25,-13.25; 86 9.75,-13.25; 87 10.25,-13.25; 88 10.75,-13.25; 133 10.75,13.25; 134 10.25,13.25; 135 9.75,13.25; 136 9.25,13.25; 137 8.75,13.25; 138 8.25,13.25; 139 7.75,13.25; 140 7.25,13.25; 141 6.75,13.25; 142 6.25,13.25; 143 5.75,13.25; 144 5.25,13.25; 145 4.75,13.25; 146 4.25,13.25; 147 3.75,13.25; 148 3.25,13.25; 149 2.75,13.25; 150 2.25,13.25; 151 1.75,13.25; 152 1.25,13.25; 153 0.75,13.25; 154 0.25,13.25; 155 -0.25,13.25; 156 -0.75,13.25; 157 -1.25,13.25; 158 -1.75,13.25; 159 -2.25,13.25; 160 -2.75,13.25; 161 -3.25,13.25; 162 -3.75,13.25; 163 -4.25,13.25; 164 -4.75,13.25; 165 -5.25,13.25; 166 -5.75,13.25; 167 -6.25,13.25; 168 -6.75,13.25; 169 -7.25,13.25; 170 -7.75,13.25; 171 -8.25,13.25; 172 -8.75,13.25; 173 -9.25,13.25; 174 -9.75,13.25; 175 -10.25,13.25; 176 -10.75,13.25
TSSOP16 = smd 0.9 x 0.35: 1 -2.875,2.275; 2 -2.875,1.625; 3 -2.875,0.975; 4 -2.875,0.325; 5 -2.875,-0.325; 6 -2.875,-0.975; 7 -2.875,-1.625; 8 -2.875,-2.275; 9 2.875,-2.275; 10 2.875,-1.625; 11 2.875,-0.975; 12 2.875,-0.325; 13 2.875,0.325; 14 2.875,0.975; 15 2.875,1.625; 16 2.875,2.275
SOIC-8 = smd 0.55 x 1.5: 1 -1.905,-2.7; 2 -0.635,-2.7; 3 0.635,-2.7; 4 1.905,-2.7; 5 1.905,2.7; 6 0.635,2.7; 7 -0.635,2.7; 8 -1.905,2.7
0805L3 = smd 0.7 x 1.3: 1 -0.95,0; 2 0.95,0
S-PQFP-G48 = smd 1.4 x 0.3: 1 -4.25,2.75; 2 -4.25,2.25; 3 -4.25,1.75; 4 -4.25,1.25; 5 -4.25,0.75; 6 -4.25,0.25; 7 -4.25,-0.25; 8 -4.25,-0.75; 9 -4.25,-1.25; 10 -4.25,-1.75; 11 -4.25,-2.25; 12 -4.25,-2.75; 25 4.25,-2.75; 26 4.25,-2.25; 27 4.25,-1.75; 28 4.25,-1.25; 29 4.25,-0.75; 30 4.25,-0.25; 31 4.25,0.25; 32 4.25,0.75; 33 4.25,1.25; 34 4.25,1.75; 35 4.25,2.25; 36 4.25,2.75 | smd 0.3 x 1.4: 13 -2.75,-4.25; 14 -2.25,-4.25; 15 -1.75,-4.25; 16 -1.25,-4.25; 17 -0.75,-4.25; 18 -0.25,-4.25; 19 0.25,-4.25; 20 0.75,-4.25; 21 1.25,-4.25; 22 1.75,-4.25; 23 2.25,-4.25; 24 2.75,-4.25; 37 2.75,4.25; 38 2.25,4.25; 39 1.75,4.25; 40 1.25,4.25; 41 0.75,4.25; 42 0.25,4.25; 43 -0.25,4.25; 44 -0.75,4.25; 45 -1.25,4.25; 46 -1.75,4.25; 47 -2.25,4.25; 48 -2.75,4.25
RELAY-G5Q = drill 1.3: 1 8.89,3.81; 2 -1.27,3.81; 3 -8.89,3.81; 4 -6.35,-3.81; 5 8.89,-3.81
STX3100 = drill 1.5 pad 2.54: 1 2.7,-0.1 | drill 1.5: 2 7.7,5; 3 7.7,2.3; 4 7.7,-2.5; 5 7.7,-5.2 | hole 1.5: 2.7,4.9; 2.7,-5.1; 7.7,-0.1

### Placement (x,y rotation side)
C1  43.69,84.73 180 bottom
C2  45.72,84.73 180 bottom
C3  47.55,81.69 0 top
C4  50.39,85.14 90 top
C5  39.01,87.38 90 top
C6  39.01,85.34 90 top
C7  134.72,84.73 180 bottom
C8  132.69,84.73 180 bottom
C9  136.55,81.69 0 top
C10  139.4,85.14 90 top
C11  128.02,87.17 90 top
C12  128.02,85.55 90 top
C13  137.77,91.85 0 top
C14  131.67,93.07 0 top
C15  138.38,35.97 270 top
C16  143.26,36.37 180 top
C17  122.53,40.44 90 top
C18  140.61,64.62 0 bottom
C19  -32.11,122.33 0 top  (outside the outline)
C20  -32.11,119.48 0 top  (outside the outline)
C21  -32.11,116.64 0 top  (outside the outline)
C22  -32.11,113.79 0 top  (outside the outline)
C23  -32.11,110.95 0 top  (outside the outline)
C24  -32.11,108.1 0 top  (outside the outline)
C25  -32.11,105.26 0 top  (outside the outline)
C26  -32.11,102.41 0 top  (outside the outline)
C27  -30.48,67.46 0 top  (outside the outline)
C28  -31.5,87.99 0 top  (outside the outline)
C29  -13.41,55.07 0 top  (outside the outline)
C30  -18.29,54.86 0 top  (outside the outline)
C31  -16.66,59.13 0 top  (outside the outline)
C32  -13.21,59.13 0 top  (outside the outline)
C33  -9.75,59.13 0 top  (outside the outline)
C34  -6.3,59.13 0 top  (outside the outline)
C35  -32.11,54.86 0 top  (outside the outline)
C36  -28.65,54.86 0 top  (outside the outline)
C37  -25.2,54.86 0 top  (outside the outline)
C38  -21.74,54.86 0 top  (outside the outline)
C39  133.71,81.69 0 top
C40  138.79,69.09 270 top
C41  134.92,77.22 270 bottom
C42  126.39,79.65 90 top
C43  141.43,70.71 270 top
C44  131.27,70.71 270 top
C45  44.7,81.69 0 top
C46  49.78,69.09 270 top
C47  -18.49,13.82 0 top  (outside the outline)
C48  -32.11,3.86 0 top  (outside the outline)
C49  -28.65,3.86 0 top  (outside the outline)
C50  -25.2,3.86 0 top  (outside the outline)
C51  48.56,92.05 0 top
C52  42.47,93.07 0 top
D1  138.58,44.7 180 top
D2  144.48,44.7 180 top
D3  131.88,66.85 180 top
D4  -23.16,72.34 0 top  (outside the outline)
D5  -17.07,72.34 0 top  (outside the outline)
D6  -10.97,72.34 0 top  (outside the outline)
IC1  -68.88,73.56 0 top  (outside the outline)
IC2  112.78,67.46 90 top
OA3  140.61,61.77 0 top
OA4  132.89,61.77 0 top
OA5  124.56,61.77 0 top
OA6  119.08,67.67 0 top
OA7  51.61,61.77 0 top
OA8  43.89,61.77 0 top
OA9  35.56,61.77 0 top
OA10  30.07,67.67 0 top
OA11  128.02,74.37 0 top
OA12  138.18,74.37 0 top
OA13  39.01,74.37 0 top
OA14  49.17,74.37 0 top
R7  146.71,34.34 180 top
R8  146.71,36.37 0 top
R9  146.71,38.4 180 top
R10  139.6,42.06 180 top
R11  136.75,61.77 90 top
R12  128.42,54.25 0 top
R13  128.42,52.22 0 top
R14  128.42,50.19 0 top
R15  131.67,50.19 180 top
R16  131.67,52.22 180 top
R17  128.42,48.16 180 top
R18  128.42,61.77 90 top
R19  120.5,61.77 270 top
R20  126.19,66.85 180 top
R21  118.47,61.77 270 top
R22  112.17,57.71 0 top
R23  112.17,59.74 180 top
R24  112.17,61.77 0 top
R25  -24.38,67.87 0 top  (outside the outline)
R26  -20.52,67.87 0 top  (outside the outline)
R27  -16.66,67.87 0 top  (outside the outline)
R28  -12.8,67.87 0 top  (outside the outline)
R29  47.75,61.77 90 top
R30  -5.08,67.87 0 top  (outside the outline)
R31  -31.7,63.2 0 top  (outside the outline)
R32  -27.84,63.2 0 top  (outside the outline)
R33  -23.98,63.2 0 top  (outside the outline)
R34  -20.12,63.2 0 top  (outside the outline)
R35  -16.26,63.2 0 top  (outside the outline)
R36  39.42,61.77 90 top
R37  31.5,61.77 270 top
R38  -4.67,63.2 0 top  (outside the outline)
R39  29.46,61.77 270 top
R40  -27.84,58.93 0 top  (outside the outline)
R41  -23.98,58.93 0 top  (outside the outline)
R42  -20.12,58.93 0 top  (outside the outline)
R43  124.56,74.37 90 top
R44  128.63,79.65 90 top
R45  138.79,79.65 90 top
R46  128.63,69.09 90 top
R47  134.72,74.37 90 top
R48  131.47,74.37 90 top
R49  35.56,74.37 90 top
R50  39.62,79.65 90 top
R51  49.78,79.65 90 top
R52  39.62,69.09 90 top
R53  46.33,74.37 90 top
R54  42.27,74.37 90 top
U$1  133.71,87.38 90 top
U$2  44.7,87.38 90 top
U$3  -51.82,-24.38 0 top  (outside the outline)
U$4  115.42,34.14 270 top
U$5  129.84,34.14 270 top
U$6  144.48,52.22 0 top
U$7  115.82,50.6 180 top
U$8  -51.82,-34.75 0 top  (outside the outline)
U$9  -51.82,-45.11 0 top  (outside the outline)
U$10  -51.82,-55.47 0 top  (outside the outline)
X1  104.44,-0.41 90 top

### Tracks (layer width: path | path; a pad name or v marks a point on that pad's centre or on a via)
A1
  Top 0.356: IC2.2 111.15,61.84
  Top 0.381: 111.15,61.84 R24.1 R23.2
A2  (2 unrouted)
ADC1_COMMOUT  (via drill 0.33)
  Top 0.305: v131.88,81.89 131.96,81.97 U$1.3
  Top 0.559: C40.P$1 138.81,69.86 OA12.3 138.81,73.74 138.18,74.37 133.5,74.37 v132.89,74.98
  Bottom 0.559: v132.89,74.98 132.89,80.87 v131.88,81.89
ADC1_IN+
  Top 0.305: U$1.6 133.46,82.19 C39.P$1
  Top 0.457: C39.P$1 132.96,81.55 131.81,80.4 R44.P$2
ADC1_IN-
  Top 0.305: U$1.7 133.96,82.19 C39.P$2
  Top 0.457: C39.P$2 134.46,81.55 135.6,80.4 R45.P$2
ADC2_COMMOUT  (via drill 0.33)
  Top 0.305: U$2.3 42.95,81.97 v42.88,81.89
  Top 0.457: OA14.3 49.81,69.86 C46.P$1
  Top 0.559: v44.3,74.98 44.91,74.37 48.97,74.37 49.81,73.53 OA14.3
  Bottom 0.559: v42.88,81.89 44.3,80.47 v44.3,74.98
ADC2_IN+
  Top 0.305: U$2.6 44.45,82.19 C45.P$1
  Top 0.457: R50.P$2 42.67,80.4 C45.P$1
ADC2_IN-
  Top 0.305: U$2.7 44.95,82.19 C45.P$2
  Top 0.457: R51.P$2 46.74,80.4 C45.P$2
B1
  Top 0.356: IC2.4 112.45,63.68 112.17,63.4 112.17,60.15 112.57,59.74 R23.1
  Top 0.381: R23.1 R22.2
B2  (2 unrouted)
CH1_IN  (1 unrouted)
CH2_IN  (1 unrouted)
GND  (50 unrouted)
N$26  (1 unrouted)
N$27  (1 unrouted)
N$28  (1 unrouted)
N$29  (1 unrouted)
N$30  (1 unrouted)
N$31  (1 unrouted)
N$32  (1 unrouted)
N$33  (2 unrouted)
N$34  (1 unrouted)
N$35  (1 unrouted)
N$36  (1 unrouted)
N$37  (1 unrouted)
N$38  (1 unrouted)
N$39  (1 unrouted)
N$40  (1 unrouted)
N$41  (1 unrouted)
N$42
  Top 0.559: C17.1 125.27,37.9 125.98,38.61 125.98,40.44 U$5.4
N$43  (via drill 0.33)
  Top 0.559: R7.2 145.74,34.32 C16.+ v143.26,35.36
  Bottom 0.559: U$4.3 122.48,43.03 C17.2 133.5,42.98 | 133.5,42.98 133.6,42.98 U$5.3 | v143.26,35.36 143.26,40.44 140.61,43.08 133.6,43.08 133.5,42.98
N$44
  Top 0.559: R8.2 R7.1
N$45
  Top 0.559: R8.1 R9.2 145.74,38.42 C16.- 138.46,38.42 C15.1 138.28,38.41 132.28,38.41 127,33.12 113.79,33.12 111.61,35.31 U$4.4
N$46  (1 unrouted)
N$47  (4 unrouted)
N$48
  Top 0.559: U$4.2 125.63,35.41 130.45,40.23 135.74,40.23 137.57,42.06 R10.2
N$49
  Top 0.559: D1.1 D2.2 | OA3.3 141.25,48.59 140.55,47.89 140.55,44.82 D1.1 | D1.1 140.43,42.18 R10.1
N$50  (1 unrouted)
N$51  (4 unrouted)
N$52
  Top 0.559: OA3.6 141.25,63.02 140,61.77 | 140,61.77 140,59.1 OA3.2 | R11.2 139.06,62.72 140,61.77
N$53  (1 unrouted)
N$54  (1 unrouted)
N$55
  Top 0.559: R14.2 R15.2 R16.2 R13.2 R12.2 129.37,54.59 132.26,57.48 OA4.2 132.26,59.72 133.3,60.76 136.69,60.76 R11.1
N$56
  Top 0.559: R13.1 R12.1 122.33,54.25 U$7.4
N$57
  Bottom 0.559: U$7.3 125.02,46.79 130.05,51.82 138.99,51.82 U$6.2
N$58
  Top 0.559: R14.1 R17.2
N$59
  Top 0.559: R17.1 137.87,48.16 U$6.4
N$60
  Top 0.559: U$6.3 135.53,56.08 133.5,56.08 132.62,55.2 R16.1 R15.1
N$61
  Top 0.559: OA4.6 133.53,63.42 132.83,62.72 129.84,62.72 | R18.2 129.84,62.72 | U$7.2 117.09,54.51 119.69,57.1 128.02,57.1 129.84,58.93 129.84,62.72
N$62
  Top 0.559: 123.95,60.82 R19.2 R21.2 | 123.95,60.82 R18.1 | OA5.2 123.93,60.8 123.95,60.82
N$63
  Top 0.559: R20.2 125.2,66.81 OA5.6 125.2,63.42 124.5,62.72 R19.1
N$65  (1 unrouted)
  Top 0.559: OA6.2 118.44,62.75 R21.1
N$66  (1 unrouted)
N$68  (3 unrouted)
N$69  (2 unrouted)
N$70  (1 unrouted)
N$71  (1 unrouted)
N$72  (6 unrouted)
N$73  (2 unrouted)
N$74  (1 unrouted)
N$75  (1 unrouted)
N$76  (1 unrouted)
N$77  (2 unrouted)
N$78  (2 unrouted)
N$79  (3 unrouted)
N$80  (2 unrouted)
N$82  (2 unrouted)
N$84
  Top 0.457: R43.P$2 127.95,75.12 | 127.95,75.12 128.63,75.79 128.63,77.05 OA11.6 | R48.P$2 127.95,75.12
  Top 0.559: OA11.6 128.65,78.88 R44.P$1
N$85
  Top 0.457: R47.P$2 138.11,75.12 138.81,75.82 OA12.6
  Top 0.559: OA12.6 138.81,78.88 R45.P$1
N$89
  Top 0.457: R43.P$1 126.73,73.62 127.41,72.95 127.41,71.7 OA11.2
N$90
  Top 0.559: OA11.3 128.65,69.86 R46.P$2
N$91
  Top 0.457: OA12.2 137.57,71.7 137.57,73.15 137.1,73.62 R47.P$1 R48.P$1
N$94
  Top 0.457: R50.P$1 39.65,78.88 OA13.6 39.65,75.15 39.62,75.12 | R49.P$2 39.62,75.12 | 39.62,75.12 R54.P$2
N$95
  Top 0.457: R51.P$1 49.81,78.88 OA14.6 49.81,75.82 49.11,75.12 R53.P$2
N$98
  Top 0.457: R49.P$1 37.94,73.62 38.38,73.18 OA13.2
N$99
  Top 0.457: OA13.3 39.65,69.86 R52.P$2
N$100
  Top 0.457: R54.P$1 R53.P$1 48.1,73.62 48.54,73.18 OA14.2
N$104  (1 unrouted)
N$105  (1 unrouted)
N$106  (1 unrouted)
N$107  (1 unrouted)
N$108  (1 unrouted)
N$109  (1 unrouted)
N$110  (1 unrouted)
N$111  (2 unrouted)
N$112  (1 unrouted)
N$113  (1 unrouted)
N$114  (1 unrouted)
N$115  (1 unrouted)
N$116  (1 unrouted)
N$117  (1 unrouted)
N$118  (1 unrouted)
N$119  (1 unrouted)
SEDIFF_CH1
  Top 0.559: R46.P$1 128.63,66.85
  Top 0.813: R20.1 128.63,66.85 D3.2
SEDIFF_CH2  (2 unrouted)
V+  (24 unrouted)
  Top 0.356: C42.P$1 126.73,78.9 126.8,78.84
  Top 0.559: OA11.7 127.38,78.26 126.8,78.84
V-  (27 unrouted)
VDD  (16 unrouted)
W1
  Top 0.356: IC2.3 111.8,66.49 112.78,67.46 119.28,67.46 119.71,67.03 OA6.3
W2  (1 unrouted)